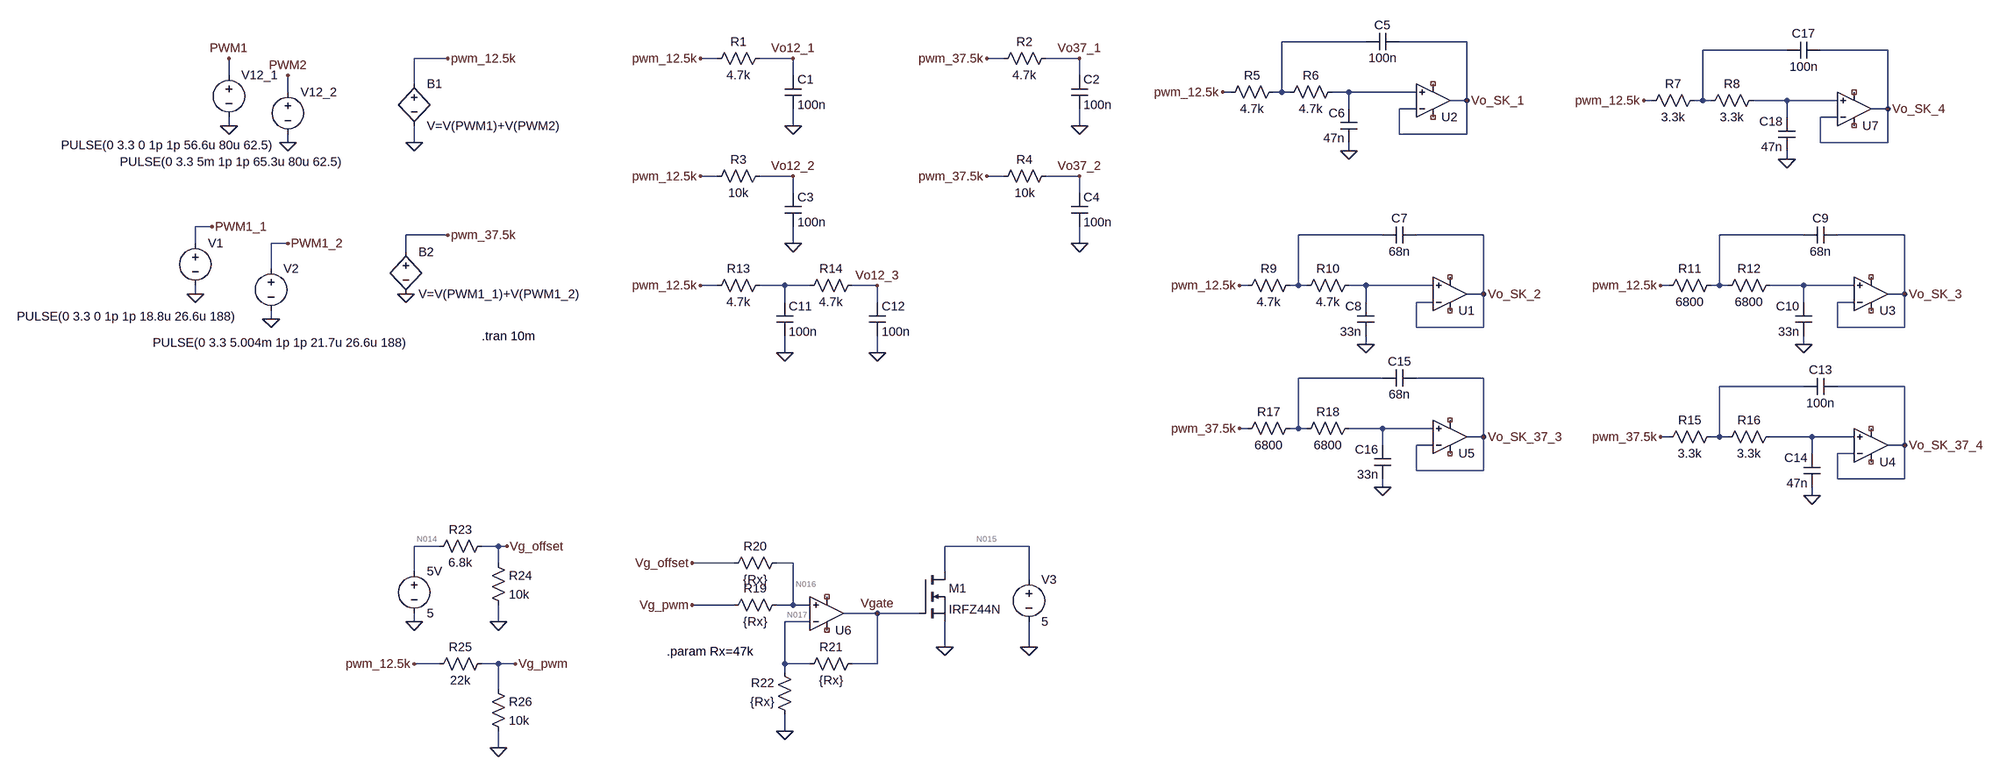
[diagram p0: schematic Filtro_PB.asc]
Filtro_PB.asc, the LTspice schematic file:
Version 4
SHEET 1 2716 1396
WIRE 1600 -32 1440 -32
WIRE 1792 -32 1664 -32
WIRE 2400 -16 2240 -16
WIRE 2592 -16 2464 -16
WIRE -144 0 -208 0
WIRE 368 0 336 0
WIRE 512 0 448 0
WIRE 912 0 880 0
WIRE 1056 0 992 0
WIRE -560 32 -560 0
WIRE 512 32 512 0
WIRE 1056 32 1056 0
WIRE -208 48 -208 0
WIRE -448 64 -448 32
WIRE 1344 64 1328 64
WIRE 1440 64 1440 -32
WIRE 1440 64 1424 64
WIRE 1456 64 1440 64
WIRE 1568 64 1536 64
WIRE 1696 64 1568 64
WIRE 1792 80 1792 -32
WIRE 1792 80 1760 80
WIRE 2144 80 2128 80
WIRE 2240 80 2240 -16
WIRE 2240 80 2224 80
WIRE 2256 80 2240 80
WIRE 2400 80 2336 80
WIRE 2496 80 2400 80
WIRE 1568 96 1568 64
WIRE 1696 96 1664 96
WIRE 2592 96 2592 -16
WIRE 2592 96 2560 96
WIRE 2400 112 2400 80
WIRE 2496 112 2464 112
WIRE -560 128 -560 112
WIRE 512 128 512 96
WIRE 1056 128 1056 96
WIRE 1664 144 1664 96
WIRE 1792 144 1792 80
WIRE 1792 144 1664 144
WIRE -448 160 -448 144
WIRE -208 160 -208 128
WIRE 2464 160 2464 112
WIRE 2592 160 2592 96
WIRE 2592 160 2464 160
WIRE 1568 176 1568 160
WIRE 2400 192 2400 176
WIRE 368 224 336 224
WIRE 512 224 448 224
WIRE 912 224 880 224
WIRE 1056 224 992 224
WIRE 512 256 512 224
WIRE 1056 256 1056 224
WIRE -592 320 -624 320
WIRE -144 336 -224 336
WIRE 1632 336 1472 336
WIRE 1824 336 1696 336
WIRE 2432 336 2272 336
WIRE 2624 336 2496 336
WIRE -624 352 -624 320
WIRE -448 352 -480 352
WIRE 512 352 512 320
WIRE 1056 352 1056 320
WIRE -224 368 -224 336
WIRE -480 400 -480 352
WIRE 368 432 336 432
WIRE 496 432 448 432
WIRE 544 432 496 432
WIRE 672 432 624 432
WIRE 1376 432 1360 432
WIRE 1472 432 1472 336
WIRE 1472 432 1456 432
WIRE 1488 432 1472 432
WIRE 1600 432 1568 432
WIRE 1728 432 1600 432
WIRE 2176 432 2160 432
WIRE 2272 432 2272 336
WIRE 2272 432 2256 432
WIRE 2288 432 2272 432
WIRE 2432 432 2368 432
WIRE 2528 432 2432 432
WIRE -624 448 -624 432
WIRE 1824 448 1824 336
WIRE 1824 448 1792 448
WIRE 2624 448 2624 336
WIRE 2624 448 2592 448
WIRE 496 464 496 432
WIRE 672 464 672 432
WIRE 1600 464 1600 432
WIRE 1728 464 1696 464
WIRE 2432 464 2432 432
WIRE 2528 464 2496 464
WIRE -480 496 -480 480
WIRE 1696 512 1696 464
WIRE 1824 512 1824 448
WIRE 1824 512 1696 512
WIRE 2496 512 2496 464
WIRE 2624 512 2624 448
WIRE 2624 512 2496 512
WIRE 1600 544 1600 528
WIRE 2432 544 2432 528
WIRE 496 560 496 528
WIRE 672 560 672 528
WIRE 1632 608 1472 608
WIRE 1824 608 1696 608
WIRE 2432 624 2272 624
WIRE 2624 624 2496 624
WIRE 1376 704 1360 704
WIRE 1472 704 1472 608
WIRE 1472 704 1456 704
WIRE 1488 704 1472 704
WIRE 1632 704 1568 704
WIRE 1728 704 1632 704
WIRE 1824 720 1824 608
WIRE 1824 720 1792 720
WIRE 2176 720 2160 720
WIRE 2272 720 2272 624
WIRE 2272 720 2256 720
WIRE 2288 720 2272 720
WIRE 2448 720 2368 720
WIRE 2528 720 2448 720
WIRE 1632 736 1632 704
WIRE 1728 736 1696 736
WIRE 2624 736 2624 624
WIRE 2624 736 2592 736
WIRE 2448 752 2448 720
WIRE 2528 752 2496 752
WIRE 1696 784 1696 736
WIRE 1824 784 1824 720
WIRE 1824 784 1696 784
WIRE 2496 800 2496 752
WIRE 2624 800 2624 736
WIRE 2624 800 2496 800
WIRE 1632 816 1632 800
WIRE 2448 832 2448 816
WIRE -160 928 -208 928
WIRE -48 928 -80 928
WIRE -32 928 -48 928
WIRE 960 928 800 928
WIRE -48 960 -48 928
WIRE 400 960 320 960
WIRE 512 960 480 960
WIRE -208 976 -208 928
WIRE 800 976 800 928
WIRE 960 992 960 928
WIRE 400 1040 320 1040
WIRE 512 1040 512 960
WIRE 512 1040 480 1040
WIRE 544 1040 512 1040
WIRE 672 1056 608 1056
WIRE 752 1056 672 1056
WIRE -208 1072 -208 1056
WIRE -48 1072 -48 1040
WIRE 544 1072 496 1072
WIRE 800 1120 800 1072
WIRE 960 1120 960 1072
WIRE -160 1152 -208 1152
WIRE -48 1152 -80 1152
WIRE -16 1152 -48 1152
WIRE 496 1152 496 1072
WIRE 544 1152 496 1152
WIRE 672 1152 672 1056
WIRE 672 1152 624 1152
WIRE 496 1168 496 1152
WIRE -48 1200 -48 1152
WIRE 496 1280 496 1248
WIRE -48 1312 -48 1280
FLAG -560 128 0
FLAG 512 128 0
FLAG -144 0 pwm_12.5k
FLAG 512 0 Vo12_1
FLAG -480 496 0
FLAG 1056 128 0
FLAG -144 336 pwm_37.5k
FLAG 1056 0 Vo37_1
FLAG 336 0 pwm_12.5k
FLAG 880 0 pwm_37.5k
FLAG 512 352 0
FLAG 512 224 Vo12_2
FLAG 1056 352 0
FLAG 1056 224 Vo37_2
FLAG 336 224 pwm_12.5k
FLAG 880 224 pwm_37.5k
FLAG -560 0 PWM1
FLAG -448 160 0
FLAG -448 32 PWM2
FLAG -208 160 0
FLAG -448 352 PWM1_2
FLAG -624 448 0
FLAG -592 320 PWM1_1
FLAG -224 448 0
FLAG 1328 64 pwm_12.5k
FLAG 1568 176 0
FLAG 1792 80 Vo_SK_1
FLAG 1360 432 pwm_12.5k
FLAG 1600 544 0
FLAG 1824 448 Vo_SK_2
FLAG 2160 432 pwm_12.5k
FLAG 2432 544 0
FLAG 2624 448 Vo_SK_3
FLAG 496 560 0
FLAG 672 432 Vo12_3
FLAG 336 432 pwm_12.5k
FLAG 672 560 0
FLAG 2448 832 0
FLAG 2624 736 Vo_SK_37_4
FLAG 2160 720 pwm_37.5k
FLAG 1632 816 0
FLAG 1824 720 Vo_SK_37_3
FLAG 1360 704 pwm_37.5k
FLAG -208 1072 0
FLAG 320 1040 Vg_pwm
FLAG 496 1280 0
FLAG -48 1072 0
FLAG -32 928 Vg_offset
FLAG 320 960 Vg_offset
FLAG -16 1152 Vg_pwm
FLAG -48 1312 0
FLAG 672 1056 Vgate
FLAG 800 1120 0
FLAG 960 1120 0
FLAG 2128 80 pwm_12.5k
FLAG 2400 192 0
FLAG 2592 96 Vo_SK_4
FLAG -208 1152 pwm_12.5k
SYMBOL voltage -560 16 R0
WINDOW 3 -319 149 Left 2
WINDOW 123 0 0 Left 0
WINDOW 39 -319 177 Left 2
SYMATTR Value PULSE(0 3.3 0 1p 1p 56.6u 80u 62.5)
SYMATTR InstName V12_1
SYMBOL res 464 -16 R90
WINDOW 0 0 56 VBottom 2
WINDOW 3 32 56 VTop 2
SYMATTR InstName R1
SYMATTR Value 4.7k
SYMBOL voltage -480 384 R0
WINDOW 3 -225 157 Left 2
WINDOW 123 0 0 Left 0
WINDOW 39 0 0 Left 0
SYMATTR Value PULSE(0 3.3 5.004m 1p 1p 21.7u 26.6u 188)
SYMATTR InstName V2
SYMBOL res 1008 -16 R90
WINDOW 0 0 56 VBottom 2
WINDOW 3 32 56 VTop 2
SYMATTR InstName R2
SYMATTR Value 4.7k
SYMBOL cap 496 32 R0
SYMATTR InstName C1
SYMATTR Value 100n
SYMBOL cap 1040 32 R0
SYMATTR InstName C2
SYMATTR Value 100n
SYMBOL res 464 208 R90
WINDOW 0 0 56 VBottom 2
WINDOW 3 32 56 VTop 2
SYMATTR InstName R3
SYMATTR Value 10k
SYMBOL res 1008 208 R90
WINDOW 0 0 56 VBottom 2
WINDOW 3 32 56 VTop 2
SYMATTR InstName R4
SYMATTR Value 10k
SYMBOL cap 496 256 R0
SYMATTR InstName C3
SYMATTR Value 100n
SYMBOL cap 1040 256 R0
SYMATTR InstName C4
SYMATTR Value 100n
SYMBOL voltage -448 48 R0
WINDOW 3 -319 149 Left 2
WINDOW 123 0 0 Left 0
WINDOW 39 -319 177 Left 2
SYMATTR Value PULSE(0 3.3 5m 1p 1p 65.3u 80u 62.5)
SYMATTR InstName V12_2
SYMBOL bv -208 32 R0
SYMATTR InstName B1
SYMATTR Value V=V(PWM1)+V(PWM2)
SYMBOL bv -224 352 R0
SYMATTR InstName B2
SYMATTR Value V=V(PWM1_1)+V(PWM1_2)
SYMBOL voltage -624 336 R0
WINDOW 3 -339 155 Left 2
WINDOW 123 0 0 Left 0
WINDOW 39 0 0 Left 0
SYMATTR Value PULSE(0 3.3 0 1p 1p 18.8u 26.6u 188)
SYMATTR InstName V1
SYMBOL OpAmps\\UniversalOpAmp 1728 80 M180
SYMATTR InstName U2
SYMBOL res 1440 48 R90
WINDOW 0 0 56 VBottom 2
WINDOW 3 32 56 VTop 2
SYMATTR InstName R5
SYMATTR Value 4.7k
SYMBOL res 1552 48 R90
WINDOW 0 0 56 VBottom 2
WINDOW 3 32 56 VTop 2
SYMATTR InstName R6
SYMATTR Value 4.7k
SYMBOL cap 1664 -48 R90
WINDOW 0 0 32 VBottom 2
WINDOW 3 32 32 VTop 2
SYMATTR InstName C5
SYMATTR Value 100n
SYMBOL cap 1584 160 R180
WINDOW 0 24 56 Left 2
WINDOW 3 24 8 Left 2
SYMATTR InstName C6
SYMATTR Value 47n
SYMBOL OpAmps\\UniversalOpAmp 1760 448 M180
SYMATTR InstName U1
SYMBOL res 1472 416 R90
WINDOW 0 0 56 VBottom 2
WINDOW 3 32 56 VTop 2
SYMATTR InstName R9
SYMATTR Value 4.7k
SYMBOL res 1584 416 R90
WINDOW 0 0 56 VBottom 2
WINDOW 3 32 56 VTop 2
SYMATTR InstName R10
SYMATTR Value 4.7k
SYMBOL cap 1696 320 R90
WINDOW 0 0 32 VBottom 2
WINDOW 3 32 32 VTop 2
SYMATTR InstName C7
SYMATTR Value 68n
SYMBOL cap 1616 528 R180
WINDOW 0 24 56 Left 2
WINDOW 3 24 8 Left 2
SYMATTR InstName C8
SYMATTR Value 33n
SYMBOL OpAmps\\UniversalOpAmp 2560 448 M180
SYMATTR InstName U3
SYMBOL res 2272 416 R90
WINDOW 0 0 56 VBottom 2
WINDOW 3 32 56 VTop 2
SYMATTR InstName R11
SYMATTR Value 6800
SYMBOL res 2384 416 R90
WINDOW 0 0 56 VBottom 2
WINDOW 3 32 56 VTop 2
SYMATTR InstName R12
SYMATTR Value 6800
SYMBOL cap 2496 320 R90
WINDOW 0 0 32 VBottom 2
WINDOW 3 32 32 VTop 2
SYMATTR InstName C9
SYMATTR Value 68n
SYMBOL cap 2448 528 R180
WINDOW 0 24 56 Left 2
WINDOW 3 24 8 Left 2
SYMATTR InstName C10
SYMATTR Value 33n
SYMBOL res 464 416 R90
WINDOW 0 0 56 VBottom 2
WINDOW 3 32 56 VTop 2
SYMATTR InstName R13
SYMATTR Value 4.7k
SYMBOL cap 480 464 R0
SYMATTR InstName C11
SYMATTR Value 100n
SYMBOL res 640 416 R90
WINDOW 0 0 56 VBottom 2
WINDOW 3 32 56 VTop 2
SYMATTR InstName R14
SYMATTR Value 4.7k
SYMBOL cap 656 464 R0
SYMATTR InstName C12
SYMATTR Value 100n
SYMBOL OpAmps\\UniversalOpAmp 2560 736 M180
SYMATTR InstName U4
SYMBOL OpAmps\\UniversalOpAmp 1760 720 M180
SYMATTR InstName U5
SYMBOL cap 1696 592 R90
WINDOW 0 0 32 VBottom 2
WINDOW 3 32 32 VTop 2
SYMATTR InstName C15
SYMATTR Value 68n
SYMBOL cap 1648 800 R180
WINDOW 0 24 56 Left 2
WINDOW 3 24 8 Left 2
SYMATTR InstName C16
SYMATTR Value 33n
SYMBOL OpAmps\\UniversalOpAmp 576 1056 M180
SYMATTR InstName U6
SYMBOL voltage -208 960 R0
SYMATTR InstName 5V
SYMATTR Value 5
SYMBOL res 496 944 R90
WINDOW 0 0 56 VBottom 2
WINDOW 3 32 56 VTop 2
SYMATTR InstName R20
SYMATTR Value {Rx}
SYMBOL res -64 912 R90
WINDOW 0 0 56 VBottom 2
WINDOW 3 32 56 VTop 2
SYMATTR InstName R23
SYMATTR Value 6.8k
SYMBOL res -64 944 R0
SYMATTR InstName R24
SYMATTR Value 10k
SYMBOL res -64 1136 R90
WINDOW 0 0 56 VBottom 2
WINDOW 3 32 56 VTop 2
SYMATTR InstName R25
SYMATTR Value 22k
SYMBOL res -64 1184 R0
SYMATTR InstName R26
SYMATTR Value 10k
SYMBOL res 496 1024 R90
WINDOW 0 0 56 VBottom 2
WINDOW 3 32 56 VTop 2
SYMATTR InstName R19
SYMATTR Value {Rx}
SYMBOL res 640 1136 R90
WINDOW 0 0 56 VBottom 2
WINDOW 3 32 56 VTop 2
SYMATTR InstName R21
SYMATTR Value {Rx}
SYMBOL res 512 1264 R180
WINDOW 0 36 76 Left 2
WINDOW 3 36 40 Left 2
SYMATTR InstName R22
SYMATTR Value {Rx}
SYMBOL nmos 752 976 R0
SYMATTR InstName M1
SYMATTR Value IRFZ44N
SYMBOL voltage 960 976 R0
WINDOW 123 0 0 Left 0
WINDOW 39 0 0 Left 0
SYMATTR InstName V3
SYMATTR Value 5
SYMBOL OpAmps\\UniversalOpAmp 2528 96 M180
SYMATTR InstName U7
SYMBOL res 2240 64 R90
WINDOW 0 0 56 VBottom 2
WINDOW 3 32 56 VTop 2
SYMATTR InstName R7
SYMATTR Value 3.3k
SYMBOL res 2352 64 R90
WINDOW 0 0 56 VBottom 2
WINDOW 3 32 56 VTop 2
SYMATTR InstName R8
SYMATTR Value 3.3k
SYMBOL cap 2464 -32 R90
WINDOW 0 0 32 VBottom 2
WINDOW 3 32 32 VTop 2
SYMATTR InstName C17
SYMATTR Value 100n
SYMBOL cap 2416 176 R180
WINDOW 0 24 56 Left 2
WINDOW 3 24 8 Left 2
SYMATTR InstName C18
SYMATTR Value 47n
SYMBOL res 1472 688 R90
WINDOW 0 0 56 VBottom 2
WINDOW 3 32 56 VTop 2
SYMATTR InstName R17
SYMATTR Value 6800
SYMBOL res 1584 688 R90
WINDOW 0 0 56 VBottom 2
WINDOW 3 32 56 VTop 2
SYMATTR InstName R18
SYMATTR Value 6800
SYMBOL res 2272 704 R90
WINDOW 0 0 56 VBottom 2
WINDOW 3 32 56 VTop 2
SYMATTR InstName R15
SYMATTR Value 3.3k
SYMBOL res 2384 704 R90
WINDOW 0 0 56 VBottom 2
WINDOW 3 32 56 VTop 2
SYMATTR InstName R16
SYMATTR Value 3.3k
SYMBOL cap 2496 608 R90
WINDOW 0 0 32 VBottom 2
WINDOW 3 32 32 VTop 2
SYMATTR InstName C13
SYMATTR Value 100n
SYMBOL cap 2464 816 R180
WINDOW 0 24 56 Left 2
WINDOW 3 24 8 Left 2
SYMATTR InstName C14
SYMATTR Value 47n
TEXT -80 528 Left 2 !.tran 10m
TEXT 272 1128 Left 2 !.param Rx=47k

The netlist it stands for:
* Filtro_PB.asc
V12_1 PWM1 0 PULSE(0 3.3 0 1p 1p 56.6u 80u 62.5)
R1 Vo12_1 pwm_12.5k 4.7k
V2 PWM1_2 0 PULSE(0 3.3 5.004m 1p 1p 21.7u 26.6u 188)
R2 Vo37_1 pwm_37.5k 4.7k
C1 Vo12_1 0 100n
C2 Vo37_1 0 100n
R3 Vo12_2 pwm_12.5k 10k
R4 Vo37_2 pwm_37.5k 10k
C3 Vo12_2 0 100n
C4 Vo37_2 0 100n
V12_2 PWM2 0 PULSE(0 3.3 5m 1p 1p 65.3u 80u 62.5)
B1 pwm_12.5k 0 V=V(PWM1)+V(PWM2)
B2 pwm_37.5k 0 V=V(PWM1_1)+V(PWM1_2)
V1 PWM1_1 0 PULSE(0 3.3 0 1p 1p 18.8u 26.6u 188)
XU2 N003 Vo_SK_1 NC_01 NC_02 Vo_SK_1 level1 Avol=1Meg GBW=10Meg Vos=0 En=0 Enk=0 In=0 Ink=0 Rin=500Meg  ; pins In+ In- V+ V- OUT
R5 N001 pwm_12.5k 4.7k
R6 N003 N001 4.7k
C5 Vo_SK_1 N001 100n
C6 0 N003 47n
XU1 N008 Vo_SK_2 NC_03 NC_04 Vo_SK_2 level1 Avol=1Meg GBW=10Meg Vos=0 En=0 Enk=0 In=0 Ink=0 Rin=500Meg  ; pins In+ In- V+ V- OUT
R9 N005 pwm_12.5k 4.7k
R10 N008 N005 4.7k
C7 Vo_SK_2 N005 68n
C8 0 N008 33n
XU3 N009 Vo_SK_3 NC_05 NC_06 Vo_SK_3 level1 Avol=1Meg GBW=10Meg Vos=0 En=0 Enk=0 In=0 Ink=0 Rin=500Meg  ; pins In+ In- V+ V- OUT
R11 N006 pwm_12.5k 6800
R12 N009 N006 6800
C9 Vo_SK_3 N006 68n
C10 0 N009 33n
R13 N007 pwm_12.5k 4.7k
C11 N007 0 100n
R14 Vo12_3 N007 4.7k
C12 Vo12_3 0 100n
XU4 N013 Vo_SK_37_4 NC_07 NC_08 Vo_SK_37_4 level1 Avol=1Meg GBW=10Meg Vos=0 En=0 Enk=0 In=0 Ink=0 Rin=500Meg  ; pins In+ In- V+ V- OUT
XU5 N012 Vo_SK_37_3 NC_09 NC_10 Vo_SK_37_3 level1 Avol=1Meg GBW=10Meg Vos=0 En=0 Enk=0 In=0 Ink=0 Rin=500Meg  ; pins In+ In- V+ V- OUT
C15 Vo_SK_37_3 N010 68n
C16 0 N012 33n
XU6 N016 N017 NC_11 NC_12 Vgate level1 Avol=1Meg GBW=10Meg Vos=0 En=0 Enk=0 In=0 Ink=0 Rin=500Meg  ; pins In+ In- V+ V- OUT
V§5V N014 0 5
R20 N016 Vg_offset {Rx}
R23 Vg_offset N014 6.8k
R24 Vg_offset 0 10k
R25 Vg_pwm pwm_12.5k 22k
R26 Vg_pwm 0 10k
R19 N016 Vg_pwm {Rx}
R21 Vgate N017 {Rx}
R22 0 N017 {Rx}
M1 N015 Vgate 0 0 IRFZ44N
V3 N015 0 5
XU7 N004 Vo_SK_4 NC_13 NC_14 Vo_SK_4 level1 Avol=1Meg GBW=10Meg Vos=0 En=0 Enk=0 In=0 Ink=0 Rin=500Meg  ; pins In+ In- V+ V- OUT
R7 N002 pwm_12.5k 3.3k
R8 N004 N002 3.3k
C17 Vo_SK_4 N002 100n
C18 0 N004 47n
R17 N010 pwm_37.5k 6800
R18 N012 N010 6800
R15 N011 pwm_37.5k 3.3k
R16 N013 N011 3.3k
C13 Vo_SK_37_4 N011 100n
C14 0 N013 47n
.model NMOS NMOS
.model PMOS PMOS
.lib standard.mos
.tran 10m
.param Rx=47k
.lib UniversalOpAmp1.lib
.backanno
.end

* Results of the author's LTspice run, read from the files saved beside the schematic
* Operating Point, zero values left out:
*   V(n017) = 1.528 V
*   V(n016) = 1.528 V
*   V(vgate) = 3.056 V
*   V(n014) = 5 V
*   V(vg_offset) = 2.861 V
*   V(vg_pwm) = 195 mV
*   V(n015) = 5 V
*   I(B1) = 8.864 µA
*   Id(M1) = 611.1 pA
*   Is(M1) = -611.1 pA
*   I(R22) = -32.51 µA
*   I(R21) = 32.51 µA
*   I(R19) = 28.37 µA
*   I(R26) = 19.5 µA
*   I(R25) = 8.864 µA
*   I(R24) = 286.1 µA
*   I(R23) = -314.5 µA
*   I(R20) = -28.37 µA
*   I(V3) = -616 pA
*   I(5v) = -314.5 µA
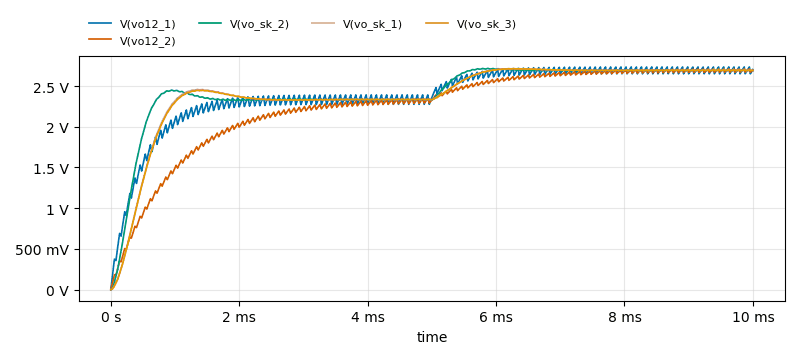
[diagram p1: Transient Analysis of Filtro_PB.asc, plotted from the saved traces]
* Transient Analysis, 1 run:
*   V(vo12_1): min 0 V, max 2.735 V, average 2.393 V, rms 2.43 V, last 2.704 V
*   V(vo12_2): min 0 V, max 2.711 V, average 2.251 V, rms 2.318 V, last 2.696 V
*   V(vo_sk_2): min 0 V, max 2.718 V, average 2.436 V, rms 2.472 V, last 2.691 V
*   V(vo_sk_1): min 0 V, max 2.716 V, average 2.401 V, rms 2.449 V, last 2.692 V
*   V(vo_sk_3): min 0 V, max 2.714 V, average 2.399 V, rms 2.447 V, last 2.692 V